# Altium schematic sheet voice.SchDoc
size A4
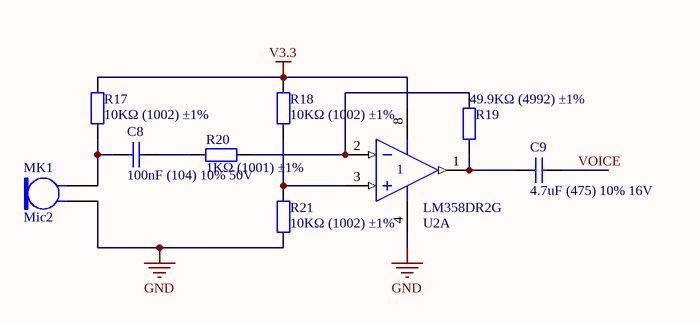
[diagram p0: voice.SchDoc]

## Parts
C8  100nF (104) 10% 50V  [0603_C]
C9  4.7uF (475) 10% 16V  [0603_C]
MK1  Mic2  [PIN2]
R17  10KΩ (1002) ±1%  [0603_R]
R18  10KΩ (1002) ±1%  [0603_R]
R19  49.9KΩ (4992) ±1%  [0603_R]
R20  1KΩ (1001) ±1%  [0603_R]
R21  10KΩ (1002) ±1%  [0603_R]
U2  LM358DR2G  [SOIC-8_150mil]  (part A of 2)

## Nets
GND: MK1.1 R21.1 U2.4(V-)
V3.3: R17.2 R18.2 U2.8(V+)
VOICE: C9.2
NetC8_1: C8.1 MK1.2 R17.1
NetC8_2: C8.2 R20.1
NetC9_1: C9.1 R19.1 U2.1(OUT)
NetR18_1: R18.1 R21.2 U2.3(IN+)
NetR19_2: R19.2 R20.2 U2.2(IN-)

## Library data of the parts
C8 = 0603 100nF (104) 10% 50V: 贴片电容; ComponentLink1Description: 供应商链接; ComponentLink1URL: http://www.szlcsc.com/product/details_15331.html; Package: 0603; Supplier: LC; SuppliersPartNumber: C14663
C9 = 0603 4.7uF (475) 10% 16V: 贴片电容; ComponentLink1Description: 供应商链接; ComponentLink1URL: http://www.szlcsc.com/product/details_20375.html; Package: 0603; Supplier: LC; SuppliersPartNumber: C19666
MK1 = Mic2: Microphone; Published: 24-Mar-1999; LatestRevisionDate: 17-Jul-2002; LatestRevisionNote: Re-released for DXP Platform.; PackageReference: PIN2; Publisher: Altium Limited
R17 R18 R21 = 0603 10KΩ (1002) 1%: 贴片电阻; ComponentLink1Description: 供应商链接; ComponentLink1URL: http://www.szlcsc.com/product/details_26547.html; Package: 0603; Supplier: LC; SuppliersPartNumber: C25804
R19 = 0603 49.9KΩ (4992) 1%: 贴片电阻; ComponentLink1Description: 供应商链接; ComponentLink1URL: http://www.szlcsc.com/product/details_23911.html; Package: 0603; Supplier: LC; SuppliersPartNumber: C23184
R20 = 0603 1KΩ (1001) 1%: 贴片电阻; ComponentLink1Description: 供应商链接; ComponentLink1URL: http://www.szlcsc.com/product/details_21904.html; Package: 0603; Supplier: LC; SuppliersPartNumber: C21190
U2 = LM358DR2G_[C7950]: 通用运放; ComponentLink1Description: 供应商链接; ComponentLink1URL: http://www.szlcsc.com/product/details_8427.html; Package: SOIC-8; Supplier: LC; SuppliersPartNumber: C7950